# EAGLE schematic stepdown-richtig (EAGLE 9.6.2)
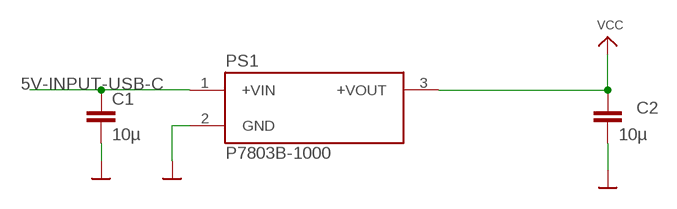
[diagram p0: schematic, sheet 1]

## Parts
C1  10µ  C-EUC1206  [C1206]
C2  10µ  C-EUC1206  [C1206]
PS1  P7803B-1000  [CONV_P7803B-1000]

## Nets
5V-INPUT-USB-C: C1.1 PS1.1(+VIN)
GND: C1.2 C2.2 PS1.2(GND)
VCC: C2.1 PS1.3(+VOUT)

## Library data of the parts
C1 C2 = rcl:C-EU: CAPACITOR, European symbol
PS1 = P7803B-1000:P7803B-1000: Check availability <https://pricing.snapeda.com/parts/P7803B-1000/CUI/view-part?ref=eda>; AVAILABILITY: In Stock; CHECK_PRICES: https://www.snapeda.com/parts/P7803B-1000/Same+Sky/view-part/?ref=eda; CUI_PURCHASE_URL: https://www.cui.com/product/dc-dc-converters/non-isolated/p78b-1000-series?utm_source=snapeda.com&utm_medium=referral&utm_campaign=snapedaBOM; DESCRIPTION: 1 A Output Current, 4.75~36 Vdc Input, 3 Pin SIP, Non-Isolated, Dc-Dc Converter; MF: CUI; MP: P7803B-1000; PACKAGE: None; PRICE: None; SNAPEDA_LINK: https://www.snapeda.com/parts/P7803B-1000/Same+Sky/view-part/?ref=snap